# Altium schematic sheet FPGA_LedChaser_EvalBoard.SchDoc: LiveDesign Evaluation - Led Chasser
size B; Organization: Altium Limited; Address1: L3, 12a Rodborough Rd; Address2: Frenchs Forest; Address3: NSW; Address4: Australia 2086; DocumentNumber: 1; SheetNumber: 1; SheetTotal: 4
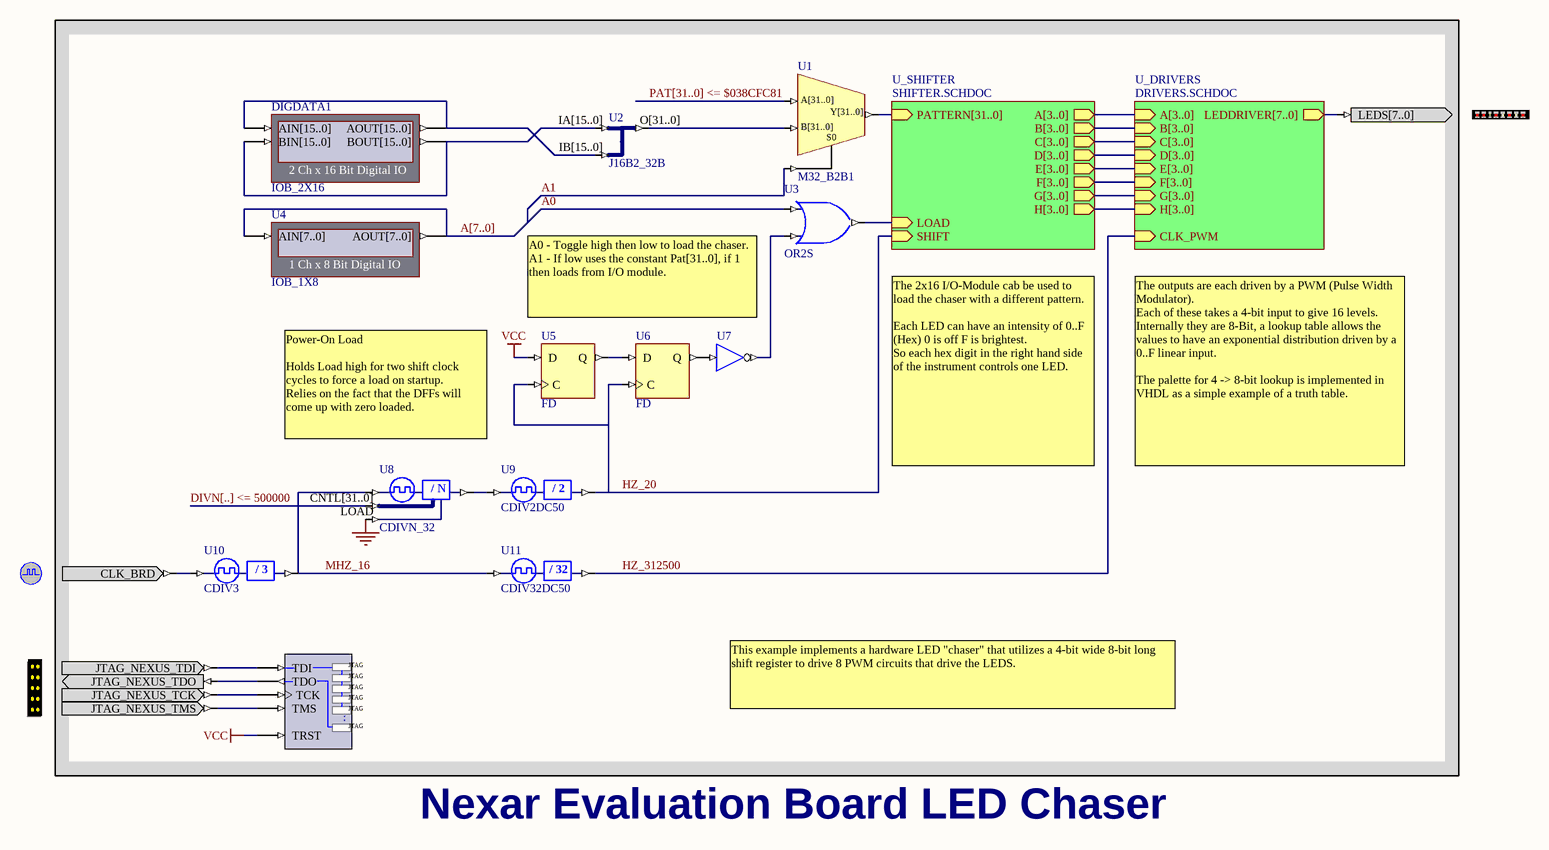
[diagram p0: FPGA_LedChaser_EvalBoard.SchDoc]

## Parts
CLOCK_BOARD  CLOCK_BOARD  (value not drawn)
DIGDATA1  IOB_2X16
LED  LED  (value not drawn)
NEXUS_JTAG_CONNECTOR  NEXUS_JTAG_CONNECTOR  (value not drawn)
NEXUS_JTAG_PORT  NEXUS_JTAG_PORT  (value not drawn)
U1  M32_B2B1
U2  J16B2_32B
U3  OR2S
U4  IOB_1X8
U5  FD
U6  FD
U7  INV  (value not drawn)
U8  CDIVN_32
U9  CDIV2DC50
U10  CDIV3
U11  CDIV32DC50

## Sub-sheets
U_DRIVERS = DRIVERS.SCHDOC: LEDDRIVER[7..0] (out), A[3..0] (in), B[3..0] (in), C[3..0] (in), D[3..0] (in), E[3..0] (in), F[3..0] (in), G[3..0] (in), H[3..0] (in), CLK_PWM (in)
U_SHIFTER = SHIFTER.SCHDOC: A[3..0] (out), B[3..0] (out), C[3..0] (out), D[3..0] (out), E[3..0] (out), F[3..0] (out), G[3..0] (out), H[3..0] (out), PATTERN[31..0] (in), SHIFT (in), LOAD (in)

## Nets
GND: U8.LOAD
VCC: NEXUS_JTAG_PORT.TRST U5.D
A0: U3.I0
A1: U1.S0
A[7..0]: U4.AIN[7..0] U4.AOUT[7..0]
DIVN[..] <= 500000: U8.CNTL[31..0]
HZ_20: U5.C U6.C U9.CLKDV ; sheet U_SHIFTER/SHIFT
HZ_312500: U11.CLKDV ; sheet U_DRIVERS/CLK_PWM
MHZ_16: U8.CLKIN U10.CLKDV U11.CLKIN
PAT[31..0] <= $038CFC81: U1.A[31..0]
NetCLOCK_BOARD_CLK_BRD: CLOCK_BOARD.CLK_BRD U10.CLKIN
NetDIGDATA1_AIN[15..0]: DIGDATA1.AIN[15..0] DIGDATA1.AOUT[15..0] U2.IB[15..0]
NetDIGDATA1_BIN[15..0]: DIGDATA1.BIN[15..0] DIGDATA1.BOUT[15..0] U2.IA[15..0]
NetLED_LEDS[7..0]: LED.LEDS[7..0] ; sheet U_DRIVERS/LEDDRIVER[7..0]
NetNEXUS_JTAG_CONNECTOR_JTAG_NEXUS_TCK: NEXUS_JTAG_CONNECTOR.JTAG_NEXUS_TCK NEXUS_JTAG_PORT.TCK
NetNEXUS_JTAG_CONNECTOR_JTAG_NEXUS_TDI: NEXUS_JTAG_CONNECTOR.JTAG_NEXUS_TDI NEXUS_JTAG_PORT.TDI
NetNEXUS_JTAG_CONNECTOR_JTAG_NEXUS_TDO: NEXUS_JTAG_CONNECTOR.JTAG_NEXUS_TDO NEXUS_JTAG_PORT.TDO
NetNEXUS_JTAG_CONNECTOR_JTAG_NEXUS_TMS: NEXUS_JTAG_CONNECTOR.JTAG_NEXUS_TMS NEXUS_JTAG_PORT.TMS
NetU1_B[31..0]: U1.B[31..0] U2.O[31..0]
NetU1_Y[31..0]: U1.Y[31..0] ; sheet U_SHIFTER/PATTERN[31..0]
NetU3_I1: U3.I1 U7.O
NetU3_O: U3.O ; sheet U_SHIFTER/LOAD
NetU5_Q: U5.Q U6.D
NetU6_Q: U6.Q U7.I
NetU8_CLKDV: U8.CLKDV U9.CLKIN

## Buses and harness runs
bus A[7..0]
bus DIVN[..] <= 500000
bus PAT[31..0] <= $038CFC81
bus sheet U_DRIVERS/A[3..0] = sheet U_SHIFTER/A[3..0]
bus sheet U_DRIVERS/B[3..0] = sheet U_SHIFTER/B[3..0]
bus sheet U_DRIVERS/C[3..0] = sheet U_SHIFTER/C[3..0]
bus sheet U_DRIVERS/D[3..0] = sheet U_SHIFTER/D[3..0]
bus sheet U_DRIVERS/E[3..0] = sheet U_SHIFTER/E[3..0]
bus sheet U_DRIVERS/F[3..0] = sheet U_SHIFTER/F[3..0]
bus sheet U_DRIVERS/G[3..0] = sheet U_SHIFTER/G[3..0]
bus sheet U_DRIVERS/H[3..0] = sheet U_SHIFTER/H[3..0]

## Notes on the sheet
- A0 - Toggle high then low to load the chaser.
  A1 - If low uses the constant Pat[31..0], if 1 then loads from I/O module.
- Power-On Load
  Holds Load high for two shift clock cycles to force a load on startup.
  Relies on the fact that the DFFs will come up with zero loaded.
- The 2x16 I/O-Module cab be used to load the chaser with a different pattern.
  Each LED can have an intensity of 0..F (Hex) 0 is off F is brightest.
  So each hex digit in the right hand side of the instrument controls one LED.
- The outputs are each driven by a PWM (Pulse Width Modulator).
  Each of these takes a 4-bit input to give 16 levels.
  Internally they are 8-Bit, a lookup table allows the values to have an exponential distribution driven by a 0..F linear input.
  The palette for 4 -> 8-bit lookup is implemented in VHDL as a simple example of a truth table.
- This example implements a hardware LED "chaser" that utilizes a 4-bit wide 8-bit long shift register to drive 8 PWM circuits that drive the LEDS.
- Nexar Evaluation Board LED Chaser
- Title
- Size:
- Date:
- B
- Number:
- Time:
- Revision:
- Sheet
- of
- File:
- (in symbol CDIV2DC50) / 2
- (in symbol CDIV3) / 3
- (in symbol CDIV32DC50) / 32
- (in symbol CDIVN_32) / N
- (in symbol NEXUS_JTAG_PORT) JTAG; .

## Library data of the parts
CLOCK_BOARD = CLOCK_BOARD: Global System Clock Supply; PortComponent: True; Published: 19-Nov-2003; Publisher: Altium Limited
DIGDATA1 = IOB_2X16: 2 Ch x 16 Bit Digital IO; NEXUS_CORE: Instrument; NEXUS_JTAG_DEVICE: True; NEXUS_JTAG_ORDER: 0; Published: 30/09/2003; Publisher: Altium Hobart Technology Centre; Core Revision: 1.00.00
LED = LED: 8-Way LEDS; PortComponent: True; Published: 19-Nov-2003; Publisher: Altium Limited
NEXUS_JTAG_CONNECTOR = NEXUS_JTAG_CONNECTOR: JTAG Port; PortComponent: True; Published: 19-Nov-2003; Publisher: Altium Limited
NEXUS_JTAG_PORT = NEXUS_JTAG_PORT: Soft Nexus-Chain Connector; NEXUS_JTAG_CONNECTOR: True; Published: 18-Dec-2003; Publisher: Altium Limited
U1 = M32_B2B1: 2x32-Bit Bus to 1x32-Bit Bus Multiplexer; ArchiveName: GENERIC; VHDLIB_SIM: GENERIC_LIB; Published: 29-Jan-2004; Publisher: Altium Limited; Core Revision: 1.00.00
U2 = J16B2_32B: 2 x 16-Bit input bus to 1 x 32-bit output bus; ArchiveName: GENERIC; VHDLIB_SIM: GENERIC_LIB; Published: 29-Jan-2004; Publisher: Altium Limited; Core Revision: 1.00.00; Revision: 31-May-2004: Output Pin (O) location changed.
U3 = OR2S: 2-Input OR Gate, Single Pin Version; Xilinx Equivalent: OR2; ArchiveName: GENERIC; VHDLIB_SIM: GENERIC_LIB; Published: 29-Jan-2004; Publisher: Altium Limited; Core Revision: 1.00.00
U4 = IOB_1X8: 1 Ch x 8 Bit Digital IO; NEXUS_CORE: Instrument; NEXUS_JTAG_DEVICE: True; NEXUS_JTAG_ORDER: 0; Published: 30/09/2003; Publisher: Altium Hobart Technology Centre; Core Revision: 1.00.00
U5 U6 = FD: D-Type Flip-Flop; ArchiveName: GENERIC; VHDLIB_SIM: GENERIC_LIB; Published: 29-Jan-2004; Publisher: Altium Limited; Xilinx Equivalent: FD; Core Revision: 1.00.00
U7 = INV: Inverter; ArchiveName: GENERIC; VHDLIB_SIM: GENERIC_LIB; Published: 29-Jan-2004; Publisher: Altium Limited; Xilinx Equivalent: INV; Core Revision: 1.00.00
U8 = CDIVN_32: 32-Bit Programmable Clock Divider; ArchiveName: GENERIC; VHDLIB_SIM: GENERIC_LIB; Published: 29-Jan-2004; Publisher: Altium Limited; Core Revision: 1.00.00
U9 = CDIV2DC50: Clock Divider by 2 with 50% Duty Cycle Output; Xilinx Equivalent: CLK_DIV2; ArchiveName: GENERIC; VHDLIB_SIM: GENERIC_LIB; Published: 29-Jan-2004; Publisher: Altium Limited; Core Revision: 1.00.00
U10 = CDIV3: Clock Divider by 3; ArchiveName: GENERIC; VHDLIB_SIM: GENERIC_LIB; Published: 29-Jan-2004; Publisher: Altium Limited; Core Revision: 1.00.00
U11 = CDIV32DC50: Clock Divider by 32 with 50% Duty Cycle Output; ArchiveName: GENERIC; VHDLIB_SIM: GENERIC_LIB; Published: 29-Jan-2004; Publisher: Altium Limited; Core Revision: 1.00.00